# EAGLE design AJAPixel (EAGLE 9.6.2)
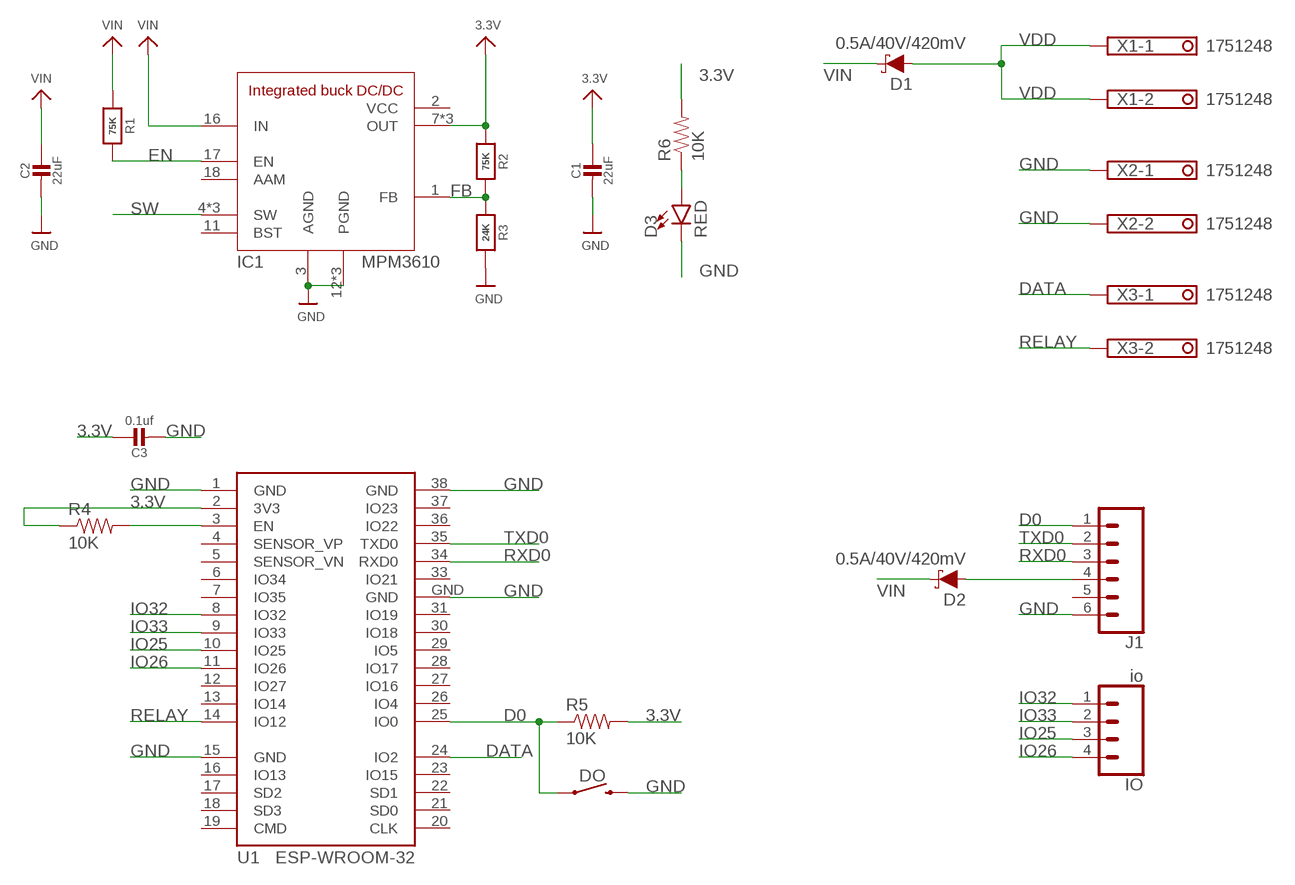
[diagram p0: schematic, sheet 1]

## Parts
C1  22uF  CAP_CERAMIC0805-NOOUTLINE  [0805-NO]
C2  22uF  CAP_CERAMIC0805-NOOUTLINE  [0805-NO]
C3  0.1uf  CAP_CERAMIC_0603  [_0603]
D1  0.5A/40V/420mV  DIODE-SCHOTTKY-PMEG4005EJ  [SOD-323]
D2  0.5A/40V/420mV  DIODE-SCHOTTKY-PMEG4005EJ  [SOD-323]
D3  RED  LED-RED0603  [LED-0603]
DO  MOMENTARY-SWITCH-SPST-SMD-5.2MM  [TACTILE_SWITCH_SMD_5.2MM]
IC1  MPM3610  [MPM3610]
IO  io  CONN_04  [1X04]
J1  CONN_06SILK_FEMALE_PTH  [1X06]
R1  75K  RESISTOR_0603_NOOUT  [0603-NO]
R2  75K  RESISTOR_0603_NOOUT  [0603-NO]
R3  24K  RESISTOR_0603_NOOUT  [0603-NO]
R4  10K  27OHM1/10W1%(0603)  [0603]
R5  10K  27OHM1/10W1%(0603)  [0603]
R6  10K  27OHM1/10W1%(0603)  [0603]
U1  ESP-WROOM-32  [ESP-WROOM-32]
X1  1751248  [1751248]
X2  1751248  [1751248]
X3  1751248  [1751248]

## Nets
3.3V: C1.1 C3.1 IC1.7(OUT) IC1.8(OUT) IC1.9(OUT) R2.1 R4.1 R5.2 R6.2 U1.2(3V3)
D0: DO.1 J1.1 R5.1 U1.25(IO0)
DATA: U1.24(IO2) X3.1
EN: IC1.17(EN) R1.2
FB: IC1.1(FB) R2.2 R3.1
GND: C1.2 C2.2 C3.2 D3.C DO.3 IC1.3(AGND) IC1.12(PGND) IC1.13(PGND) IC1.14(PGND) J1.6 R3.2 U1.1(GND) U1.15(GND) U1.38(GND) U1.GND X2.1 X2.2
IO25: IO.3 U1.10(IO25)
IO26: IO.4 U1.11(IO26)
IO32: IO.1 U1.8(IO32)
IO33: IO.2 U1.9(IO33)
N$1: D3.A R6.1
N$2: D2.A J1.4
N$3: R4.2 U1.3(EN)
RELAY: U1.14(IO12) X3.2
RXD0: J1.3 U1.34(RXD0)
SW: IC1.4(SW) IC1.5(SW) IC1.6(SW)
TXD0: J1.2 U1.35(TXD0)
VDD: D1.A X1.1 X1.2
VIN: C2.1 D1.C D2.C IC1.16(IN) R1.1
Unconnected: IC1.11(BST) IC1.18(AAM) J1.5 U1.4(SENSOR_VP) U1.5(SENSOR_VN) U1.6(IO34) U1.7(IO35) U1.12(IO27) U1.13(IO14) U1.16(IO13) U1.17(SD2) U1.18(SD3) U1.19(CMD) U1.20(CLK) U1.21(SD0) U1.22(SD1) U1.23(IO15) U1.26(IO4) U1.27(IO16) U1.28(IO17) U1.29(IO5) U1.30(IO18) U1.31(IO19) U1.33(IO21) U1.36(IO22) U1.37(IO23)

## Power pins joined to a net without a drawn wire
VCC: IC1.2(VCC)

## Library data of the parts
C1 C2 = microbuilder:CAP_CERAMIC: Ceramic Capacitors For new designs, use the packages preceded by an '_' character since they are more reliable: The following footprints should be used on most boards: _0402 - Standard footprint for regular board layouts _0603 - Standard footprint for regular board layouts _0805 - Standard footprint for regular board layouts _1206 - Standard footprint for regular board layouts For extremely tight-pitch boards where space is at a premium, the following 'micro-pitch' footprints can be used (smaller pads, no silkscreen outline, etc.): _0402MP - Micro-pitch footprint for very dense/compact boards _0603MP - Micro-pitch footprint for very dense/compact boards _0805MP - Micro-pitch footprint for very dense/compact boards _1206MP - Micro-pitch footprint for very dense/compact boards
C3 = Nicks:CAP_CERAMIC: Ceramic Capacitors For new designs, use the packages preceded by an '_' character since they are more reliable: The following footprints should be used on most boards: _0402 - Standard footprint for regular board layouts _0603 - Standard footprint for regular board layouts _0805 - Standard footprint for regular board layouts _1206 - Standard footprint for regular board layouts For extremely tight-pitch boards where space is at a premium, the following 'micro-pitch' footprints can be used (smaller pads, no silkscreen outline, etc.): _0402MP - Micro-pitch footprint for very dense/compact boards _0603MP - Micro-pitch footprint for very dense/compact boards _0805MP - Micro-pitch footprint for very dense/compact boards _1206MP - Micro-pitch footprint for very dense/compact boards
D1 D2 = Nicks:DIODE-SCHOTTKY: Schottky diode A Schottky diode is a semiconductor diode which has a low forward voltage drop and a very fast switching action.; PROD_ID: DIO-10955
D3 = Nicks:LED-RED: Red SMD LED Used in manufacturing of most products at SparkFun Packages: 0603 - SMD 0603 package [Product Link] <http://docs.avagotech.com/docs/AV02-0551EN> 0603 SMART - SMD 0603 SMART package ( more efficient and expensive)[Product Link] <http://www.osram-os.com/Graphics/XPic2/00077099_0.pdf> 1206 - SMD1206 package [Product Link] <https://www.sparkfun.com/datasheets/DevTools/LilyPad/Q150OVS4.pdff> SparkFun Products: Pro Mini 328 -5V <https://www.sparkfun.com/products/821> RedBoard <https://www.sparkfun.com/products/12757> IOIO-OTG <https://www.sparkfun.com/products/13613>; PROD_ID: DIO-00819
DO = Nicks:MOMENTARY-SWITCH-SPST: Momentary Switch (Pushbutton) - SPST Normally-open (NO) SPST momentary switches (buttons, pushbuttons). Variants PTH-12MM - 12mm square, through-hole Momentary Pushbutton Switch - 12mm Square <https://www.sparkfun.com/products/9190> (COM-09190) PTH-6.0MM, PTH-6.0MM-KIT - 6.0mm square, through-hole Mini Pushbutton Switch <https://www.sparkfun.com/products/97> (COM-00097) KIT package intended for soldering kit's - only one side of pads' copper is exposed. PTH-RIGHT-ANGLE-KIT - Right-angle, through-hole Right Angle Tactile Button <https://www.sparkfun.com/products/10791> - Used on SparkFun BigTime Watch Kit <https://www.sparkfun.com/products/11734> SMD-12MM - 12mm square, surface-mount Tactile Button - SMD (12mm) <https://www.sparkfun.com/products/12993> (COM-12993) Used on SparkFun PicoBoard <https://www.sparkfun.com/products/11888> SMD-4.5MM - 4.5mm Square Trackball Switch Used on SparkFun Blackberry Trackballer Breakout <https://www.sparkfun.com/products/13169> SMD-4.6MMX2.8MM - 4.60mm x 2.80mm, surface mount Used on SparkFun SAMD21 Mini Breakout <https://www.sparkfun.com/products/13664> SMD-5.2MM, SMD-5.2-REDUNDANT - 5.2mm square, surface-mount Mini Pushbutton Switch - SMD <https://www.sparkfun.com/products/8720> (COM-08720) Used on Arduino Pro Mini <https://www.sparkfun.com/products/11114> REDUNDANT package connects both switch circuits together SMD-6.0X3.5MM - 6.0 x 3.5mm, surface mount Momentary Reset Switch SMD <https://www.sparkfun.com/products/8229> (COM-08229) SMD-6.2MM-TALL - 6.2mm square, surface mount Tactile Button - SMD (6mm) <https://www.sparkfun.com/products/12992> Used on SparkFun Digital Sandbox <https://www.sparkfun.com/products/12651> SMD-RIGHT-ANGLE - Right-angle, surface mount Used on SparkFun Block for Intel® Edison - Arduino <https://www.sparkfun.com/products/13036>; PROD_ID: SWCH-08247; SF_SKU: COM-08720
IC1 = microbuilder:MPM3610
IO = SparkFun-Connectors:CONN_04: Multi connection point. Often used as Generic Header-pin footprint for 0.1 inch spaced/style header connections On any of the 0.1 inch spaced packages, you can populate with these: Break Away Headers - Straight <https://www.sparkfun.com/products/116> (PRT-00116) Break Away Male Headers - Right Angle <https://www.sparkfun.com/products/553> (PRT-00553) Female Headers <https://www.sparkfun.com/products/115> (PRT-00115) Break Away Headers - Machine Pin <https://www.sparkfun.com/products/117> (PRT-00117) Break Away Female Headers - Swiss Machine Pin <https://www.sparkfun.com/products/743> (PRT-00743) For SCREWTERMINALS and SPRING TERMINALS visit here: Screw Terimnals on SparkFun.com <https://www.sparkfun.com/search/results?term=Screw+Terminals> (5mm/3.5mm/2.54mm spacing) This device is also useful as a general connection point to wire up your design to another part of your project. Our various solder wires solder well into these plated through hole pads. Hook-Up Wire - Assortment (Stranded, 22 AWG) <https://www.sparkfun.com/products/11375> (PRT-11375) Hook-Up Wire - Assortment (Solid Core, 22 AWG) <https://www.sparkfun.com/products/11367> (PRT-11367) View the entire wire category on our website here <https://www.sparkfun.com/categories/141> Special notes: Molex polarized connector foot print use with SKU : PRT-08231 with associated crimp pins and housings. 1MM SMD Version SKU: PRT-10208; PROD_ID: CONN-09696
J1 = SparkFun-Connectors:CONN_06: Multi connection point. Often used as Generic Header-pin footprint for 0.1 inch spaced/style header connections On any of the 0.1 inch spaced packages, you can populate with these: Break Away Headers - Straight <https://www.sparkfun.com/products/116> (PRT-00116) Break Away Male Headers - Right Angle <https://www.sparkfun.com/products/553> (PRT-00553) Female Headers <https://www.sparkfun.com/products/115> (PRT-00115) Break Away Headers - Machine Pin <https://www.sparkfun.com/products/117> (PRT-00117) Break Away Female Headers - Swiss Machine Pin <https://www.sparkfun.com/products/743> (PRT-00743) Arduino Stackable Header - 6 Pin <https://www.sparkfun.com/products/9280> (PRT-09280) For SCREWTERMINALS and SPRING TERMINALS visit here: Screw Terimnals on SparkFun.com <https://www.sparkfun.com/search/results?term=Screw+Terminals> (5mm/3.5mm/2.54mm spacing) This device is also useful as a general connection point to wire up your design to another part of your project. Our various solder wires solder well into these plated through hole pads. Hook-Up Wire - Assortment (Stranded, 22 AWG) <https://www.sparkfun.com/products/11375> (PRT-11375) Hook-Up Wire - Assortment (Solid Core, 22 AWG) <https://www.sparkfun.com/products/11367> (PRT-11367) View the entire wire category on our website here <https://www.sparkfun.com/categories/141>; PROD_ID: CONN-08437
R1-R3 = microbuilder:RESISTOR: Resistors For new designs, use the packages preceded by an '_' character since they are more reliable: The following footprints should be used on most boards: _0402 - Standard footprint for regular board layouts _0603 - Standard footprint for regular board layouts _0805 - Standard footprint for regular board layouts _1206 - Standard footprint for regular board layouts For extremely tight-pitch boards where space is at a premium, the following 'micro-pitch' footprints can be used (smaller pads, no silkscreen outline, etc.): _0402MP - Micro-pitch footprint for very dense/compact boards _0603MP - Micro-pitch footprint for very dense/compact boards _0805MP - Micro-pitch footprint for very dense/compact boards _1206MP - Micro-pitch footprint for very dense/compact boards
R4-R6 = Nicks:27OHM1/10W1%(0603): RES-09334; PROD_ID: RES-09334; VALUE: 27
U1 = Nicks:ESP-WROOM-32: Espressif Systems ESP-WROOM-32
X1-X3 = con-phoenix-350:1751248: MKDS 1/ 2-3,5 Printklemme Nennstrom: 10 A Bemessungsspannung: 160 V Raster: 3,5 mm Polzahl: 2 Montageart: Löten Anschlussart: Schraubanschluss Anschlussrichtung vom Leiter zur Platine: 0° Source: http://eshop.phoenixcontact.com .. 1751248.pdf; OC_FARNELL: unknown; OC_NEWARK: unknown

## Board
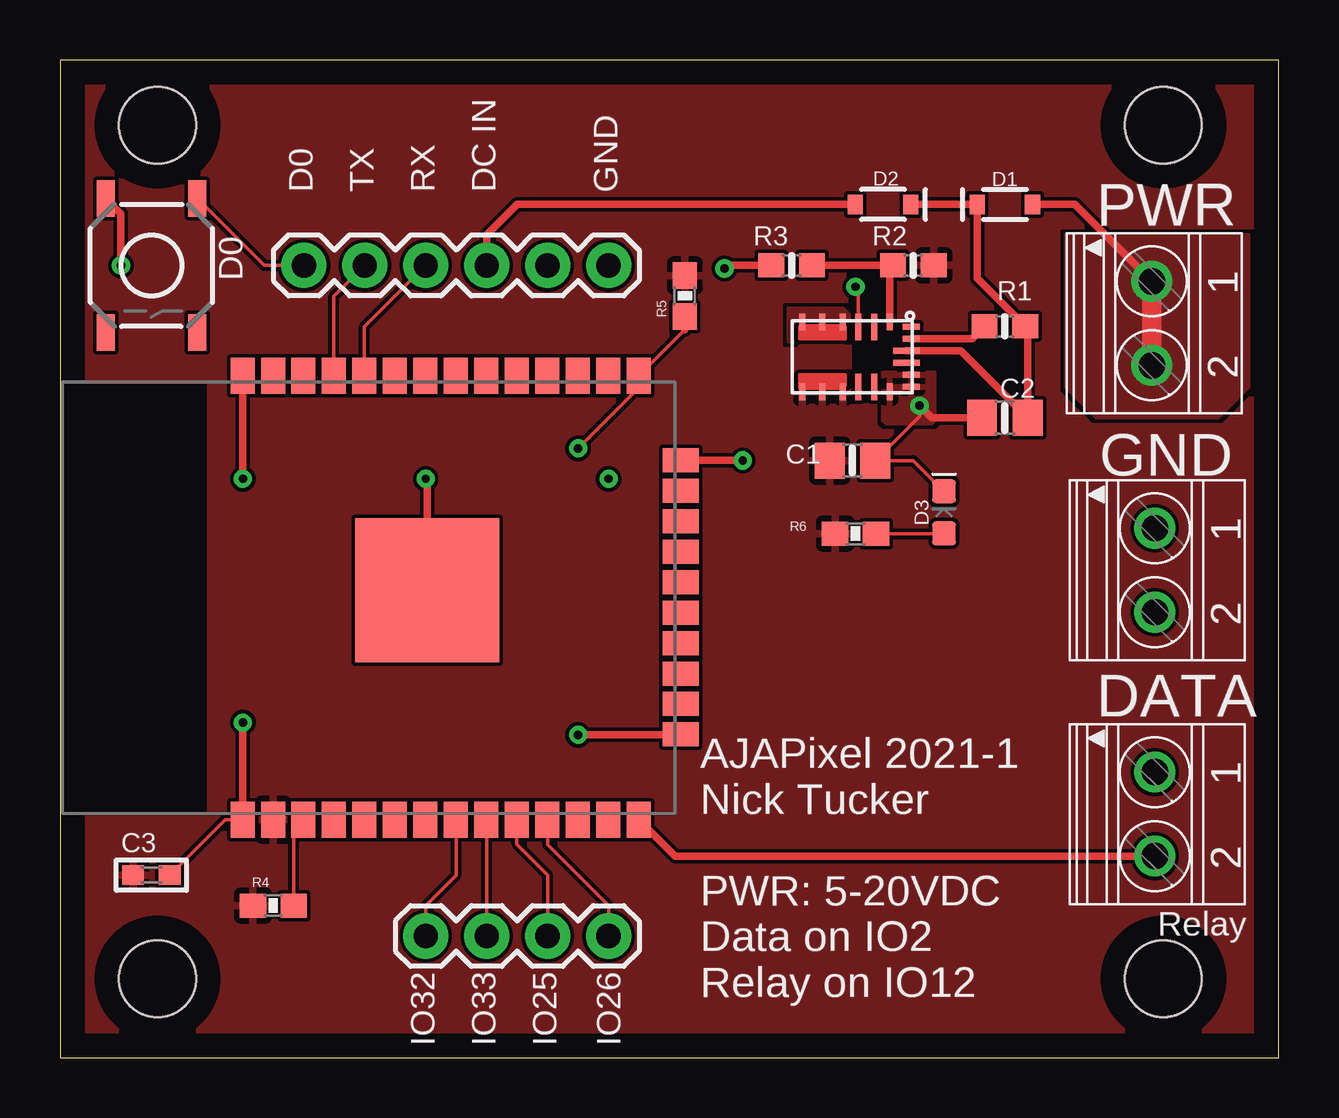
[diagram p1: board, top side]
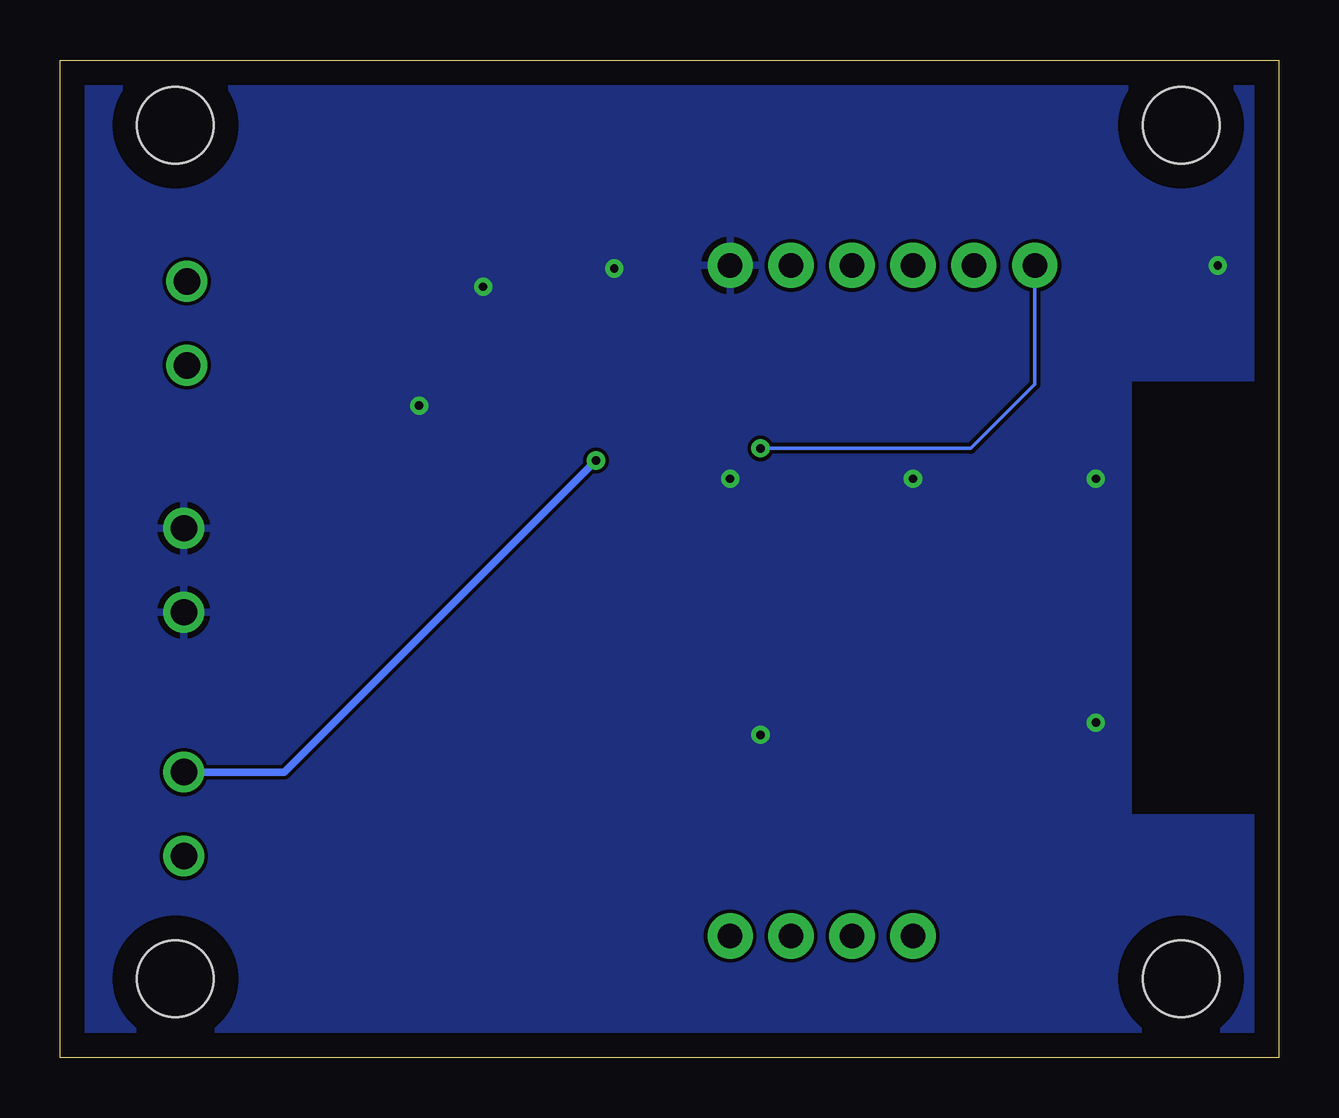
[diagram p2: board, bottom side, seen from below]

Size 50.78 x 41.58 mm. Coordinates in mm from the lower left corner, seen from the top.
Outline: 0,0 50.78,0 50.78,41.58 0,41.58 0,0
Copper layers (1*16): Top 0.035mm / dielectric 1.5mm / Bottom 0.035mm
Design rules "default": minimum track width 6mil, minimum drill 0.35mm, track to track 6mil, track to pad 6mil, pad to pad 6mil, via to via 6mil, smd to smd 6mil, copper to edge 40mil, drill to drill 6mil, minimum pad ring 10mil, minimum via ring 8mil, stop-mask expansion 4mil, vias tented up to drill 0mil, thermal gap 10mil
Holes 3.2 mm at 4.06,38.86 45.97,38.86 45.97,3.3 4.06,3.3

### Footprints (pad centres in the part's own frame; a part is rotated, then mirrored left to right if it is on the bottom)
0805-NO = smd 1.24 x 1.5: 1 -0.95,0; 2 0.95,0
_0603 = smd 0.9 x 0.8: 1 -0.762,0; 2 0.762,0
SOD-323 = smd 0.63 x 0.83: A 1.15,0; C -1.15,0
LED-0603 = smd 1 x 1: A -0.877,0; C 0.877,0
TACTILE_SWITCH_SMD_5.2MM = smd 1.524 x 0.762: 1 -2.794,1.905; 2 2.794,1.905; 3 -2.794,-1.905; 4 2.794,-1.905
MPM3610 = smd 0.7 x 0.25: 1 -1.45,1.55; 4 -1.45,-0.4; 5 -1.45,-1.25; 6 -1.45,-2.1; 7 1.45,-2.1; 8 1.45,-1.25; 9 1.45,-0.4; 12 1.45,1.55 | smd 1.1 x 0.25: 2 -1.25,0.9; 3 -1.25,0.25; 10 1.25,0.25; 11 1.25,0.9 | smd 0.25 x 0.7: 13 1.25,2.45; 14 0.75,2.45; 17 -0.75,2.45; 18 -1.25,2.45 | smd 0.25 x 1.1: 15 0.25,2.25; 16 -0.25,2.25
1X04 = drill 1.016 pad 1.88: 1 0,0; 2 2.54,0; 3 5.08,0; 4 7.62,0
1X06 = drill 1.016 pad 1.88: 1 0,0; 2 2.54,0; 3 5.08,0; 4 7.62,0; 5 10.16,0; 6 12.7,0
0603-NO = smd 1.075 x 1: 1 -0.85,0; 2 0.85,0
0603 = smd 1.1 x 1: 1 -0.85,0; 2 0.85,0
ESP-WROOM-32 = smd 1.5 x 1: 1 -9.25,7; 2 -9.25,5.73; 3 -9.25,4.46; 4 -9.25,3.19; 5 -9.25,1.92; 6 -9.25,0.65; 7 -9.25,-0.62; 8 -9.25,-1.89; 9 -9.25,-3.16; 10 -9.25,-4.43; 11 -9.25,-5.7; 12 -9.25,-6.97; 13 -9.25,-8.24; 14 -9.25,-9.51; 25 9.25,-9.51; 26 9.25,-8.24; 27 9.25,-6.97; 28 9.25,-5.7; 29 9.25,-4.43; 30 9.25,-3.16; 31 9.25,-1.89; 32 9.25,-0.62; 33 9.25,0.65; 34 9.25,1.92; 35 9.25,3.19; 36 9.25,4.46; 37 9.25,5.73; 38 9.25,7 | smd 1 x 1.5: 15 -5.7,-11.25; 16 -4.43,-11.25; 17 -3.16,-11.25; 18 -1.89,-11.25; 19 -0.62,-11.25; 20 0.65,-11.25; 21 1.92,-11.25; 22 3.19,-11.25; 23 4.46,-11.25; 24 5.73,-11.25 | smd 6 x 6: GND 0.3,-0.7
1751248 = drill 1.1 pad 1.7: 1 -1.75,-0.1; 2 1.75,-0.1

### Placement (x,y rotation side)
C1  33.02,24.89 0 top
C2  39.37,26.67 180 top
C3  3.81,7.62 0 top
D1  39.37,35.56 0 top
D2  34.29,35.56 180 top
D3  36.83,22.73 90 top
DO  3.81,33.02 270 top
IC1  33.02,29.21 270 top
IO  15.24,5.08 0 top
J1  10.16,33.02 0 top
R1  39.37,30.48 180 top
R2  35.56,33.02 180 top
R3  30.48,33.02 180 top
R4  8.89,6.35 0 top
R5  26.04,31.75 90 top
R6  33.15,21.84 180 top
U1  14.61,19.18 90 top
X1  45.59,30.61 270 top
X2  45.72,20.32 270 top
X3  45.72,10.16 270 top

### Tracks (layer width: path | path; a pad name or v marks a point on that pad's centre or on a via)
3.3V
  pour Top (rank 4): 0,41.91 50.8,41.91 52.07,40.64 52.07,-1.27 -1.27,-1.27 -1.27,41.91
D0  (via drill 0.35)
  Top 0.152: U1.25 26.04,30.35 | DO.1 8.51,33.02 J1.1 | v21.59,25.4 24.11,27.93
  Top 0.305: 26.04,30.35 R5.1 | 24.11,27.93 U1.25
  Bottom 0.152: J1.1 10.16,28.07 12.83,25.4 v21.59,25.4
DATA  (via drill 0.35)
  Top 0.305: U1.24 28.43,24.91 v28.45,24.89
  Bottom 0.305: X3.1 41.43,11.91 v28.45,24.89
EN
  Top 0.305: IC1.17 38,29.96 R1.2
FB
  Top 0.305: IC1.1 34.57,32.88 | 34.57,32.88 R2.2 | R3.1 34.43,33.02 34.57,32.88
GND  (via drill 0.35)
  Top 0.152: C3.2 6.88,9.93 U1.1 | v35.81,27.18 35.81,26.74 C1.2 35.55,24.89 D3.C | v27.69,32.89 27.81,33.02 | IC1.3 33.27,32.01 v33.15,32.13
  Top 0.305: C2.2 36.32,26.67 v35.81,27.18 | 27.81,33.02 R3.2 | U1.38 7.62,28.41 v7.62,24.13 | v15.24,24.13 15.3,24.07 U1.GND | U1.1 7.61,13.96 v7.62,13.97 | DO.3 2.54,35.18 v2.54,33.02 | v21.59,13.46 25.84,13.46 U1.15
  other vias: 22.86,24.13
  pour Bottom: -2.54,43.18 52.07,43.18 53.34,41.91 53.34,-1.27 52.07,-2.54 -2.54,-2.54
  pour Top (rank 2): 34.29,28.57 36.45,28.57 36.45,26.54 36.32,26.42 34.42,26.42 34.29,26.54 34.29,27.94
IO25
  Top 0.152: IO.3 20.32,7.62 19.04,8.9 U1.10
IO26
  Top 0.152: U1.11 20.32,9.91 20.32,8.89 22.86,6.35 IO.4
IO32
  Top 0.152: IO.1 15.24,6.35 16.51,7.62 16.51,9.91 U1.8
IO33
  Top 0.152: IO.2 17.78,9.91 U1.9
N$1
  Top 0.152: R6.1 36.82,21.84 D3.A
N$2
  Top 0.305: J1.4 17.78,34.29 19.05,35.56 D2.A
N$3
  Top 0.152: R4.2 9.74,9.52 U1.3
RELAY
  Top 0.305: U1.14 25.63,8.41 X3.2
RXD0
  Top 0.152: U1.34 12.69,30.46 J1.3
SW
  pour Top (no thermals): 32.89,29.84 30.35,29.84 30.35,31.24 32.64,31.24 32.89,30.99
TXD0
  Top 0.152: U1.35 11.41,31.73 J1.2
VDD
  Top 0.305: X1.1 42.29,35.56 D1.A
  Top 0.813: X1.2 X1.1
  pour Top (rank 2, no thermals): 41.91,34.29 41.91,27.94 43.18,26.67 48.26,26.67 49.53,27.94 49.53,34.29
VIN
  Top 0.305: D2.C D1.C 38.22,32.48 R1.1 40.32,30.38 C2.1 37.53,29.46 IC1.16

### Text on the board
tNames: D0 | TX | RX | DC IN | GND | PWR | D0 | GND | DATA | Relay | AJAPixel 2021-1 / Nick Tucker / / PWR: 5-20VDC / Data on IO2 / Relay on IO12 | IO32 | IO33 | IO25 | IO26